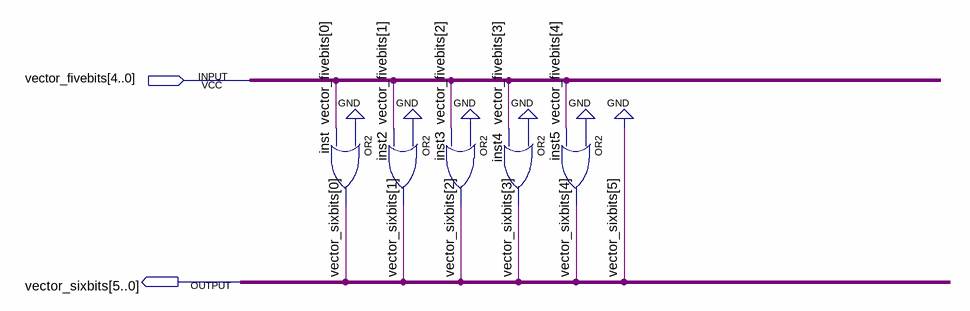
[diagram p0: schematic sheet]
// Quartus schematic fivebitstosixbits.bdf as structural Verilog: 5 symbols, 2 pins
module fivebitstosixbits (
  input  [4:0] vector_fivebits,
  output [5:0] vector_sixbits
);

  or inst (vector_sixbits[0], 1'b0, vector_fivebits[0]);
  or inst2 (vector_sixbits[1], 1'b0, vector_fivebits[1]);
  or inst3 (vector_sixbits[2], 1'b0, vector_fivebits[2]);
  or inst4 (vector_sixbits[3], 1'b0, vector_fivebits[3]);
  or inst5 (vector_sixbits[4], 1'b0, vector_fivebits[4]);

  assign vector_sixbits[5] = 1'b0;
endmodule
